# EAGLE design Header -LM35 Temp Sensor (EAGLE 6.3)
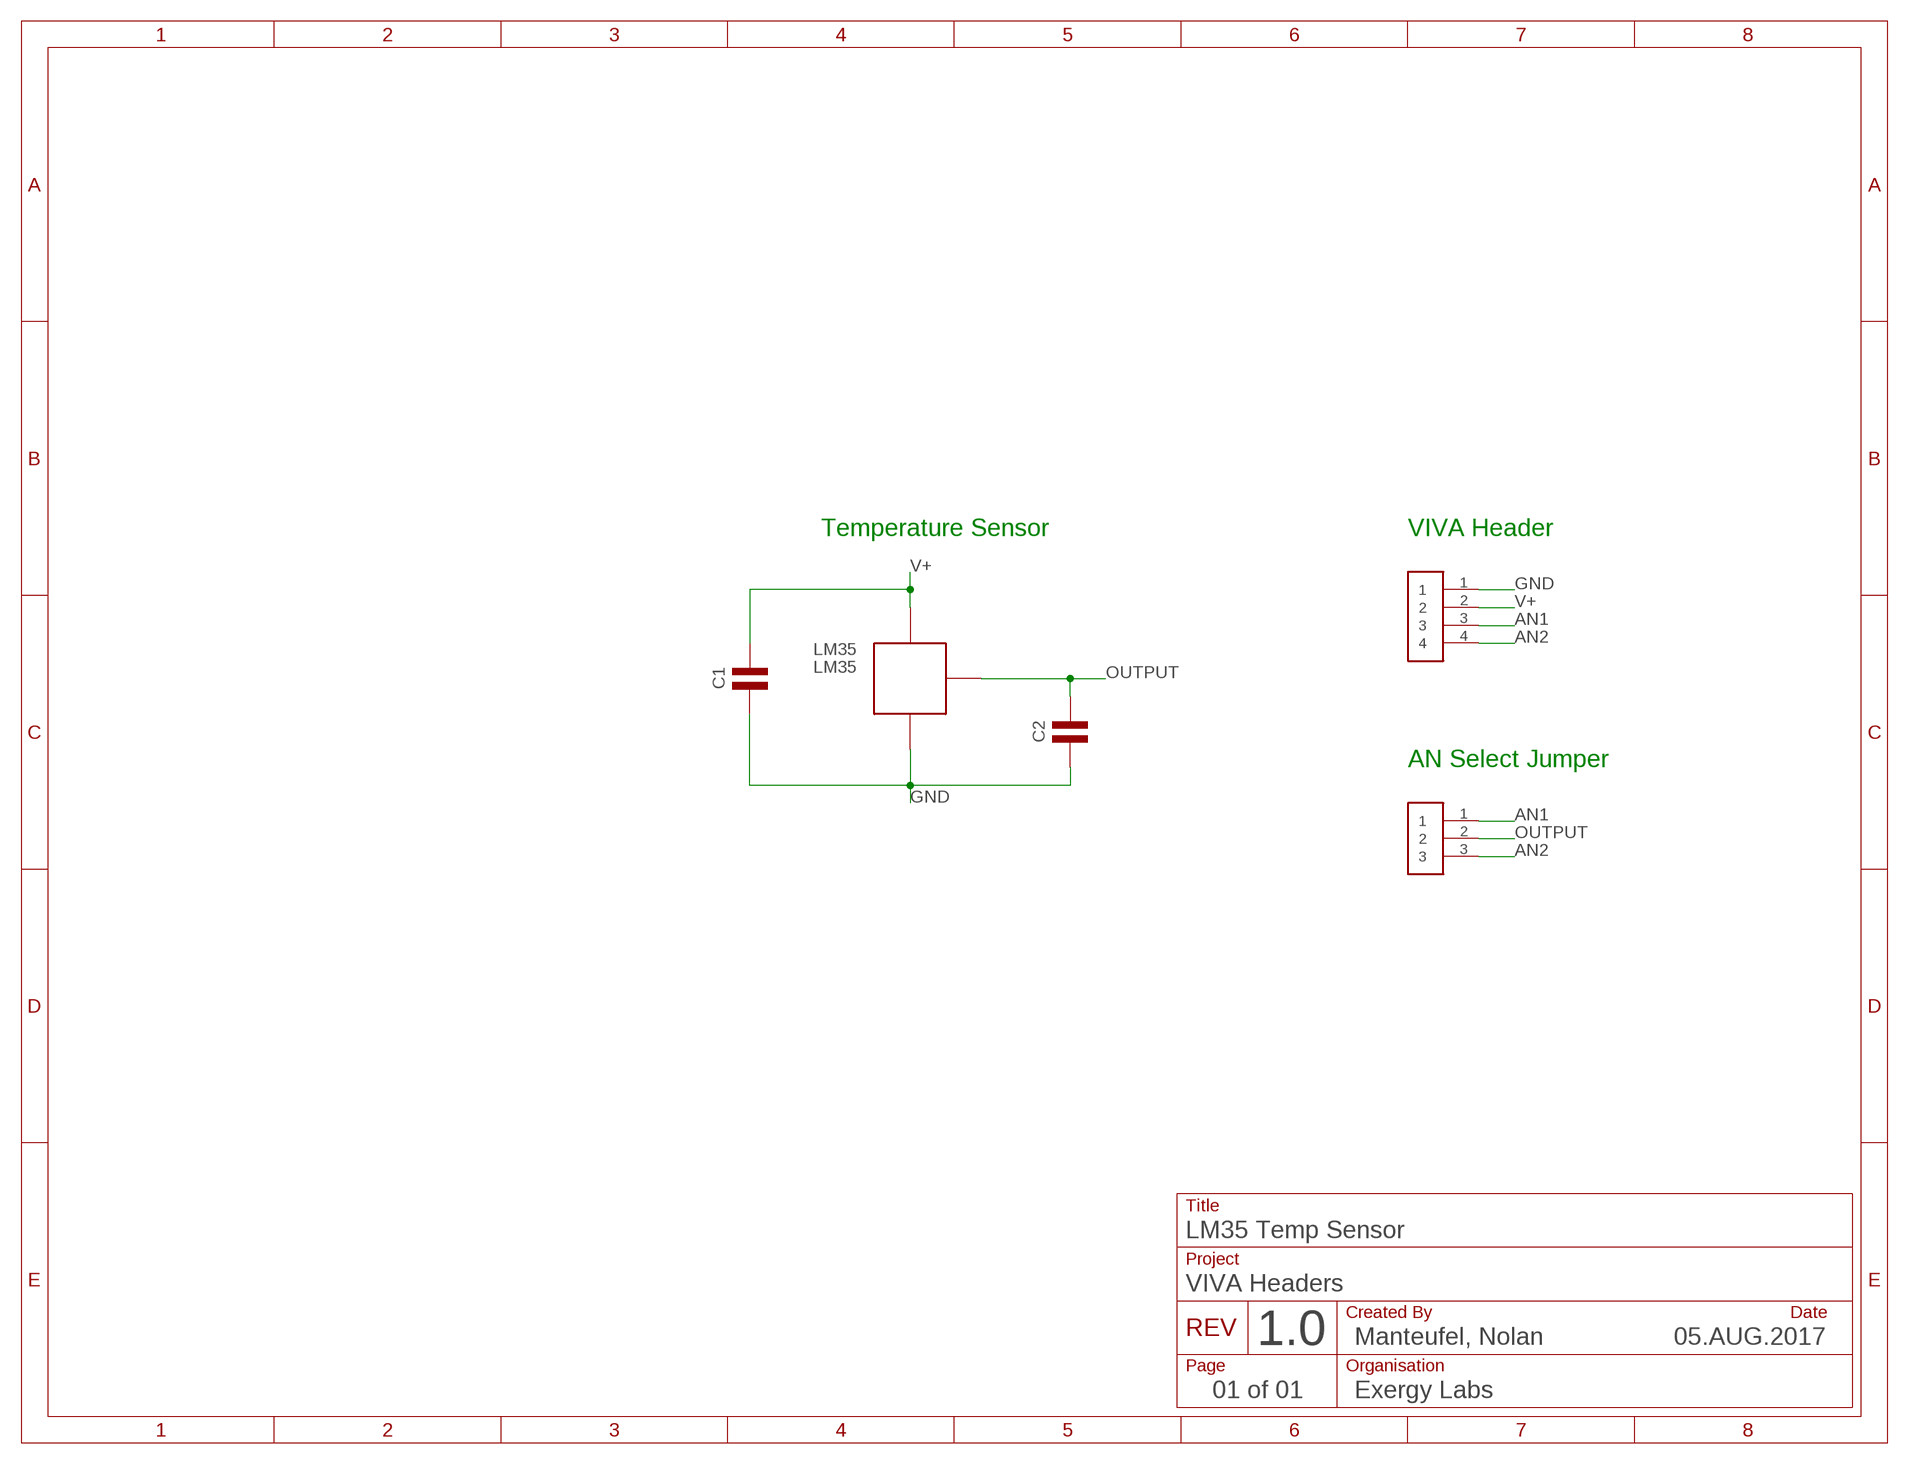
[diagram p0: schematic, sheet 1]

## Parts
C1  COVAL  [C050-024X044]
C2  COVAL  [C050-024X044]
LM35  LM35  [TO92-]
U$2  PINS_4  [PINS_4]
U$3  PINS_3  [PINS_3]

## Nets
AN1: U$2.3 U$3.1
AN2: U$2.4 U$3.3
GND: C1.1 C2.1 LM35.1(GND) U$2.1
OUTPUT: C2.2 LM35.2(VOUT) U$3.2
V+: C1.2 LM35.3(+V) U$2.2

## Notes on the sheet
- Temperature Sensor | VIVA Header
- AN Select Jumper
- Title
- LM35 Temp Sensor
- Project
- VIVA Headers
- Created By | Date
- 05.AUG.2017
- REV
- 1.0 | Manteufel, Nolan
- Page | Organisation
- 01 of 01 | Exergy Labs
- C:/Users/Nolan/Documents/eagle/VIVA  Board/Header - LM35 Temp Sensor/LM35 Temp Sensor - 05AUG2017.bmp

## Library data of the parts
C1 C2 = nolan-utsa:C
LM35 = nolan-utsa:LM35
U$2 = nolan-utsa:PINS_4
U$3 = nolan-utsa:PINS_3

## Board
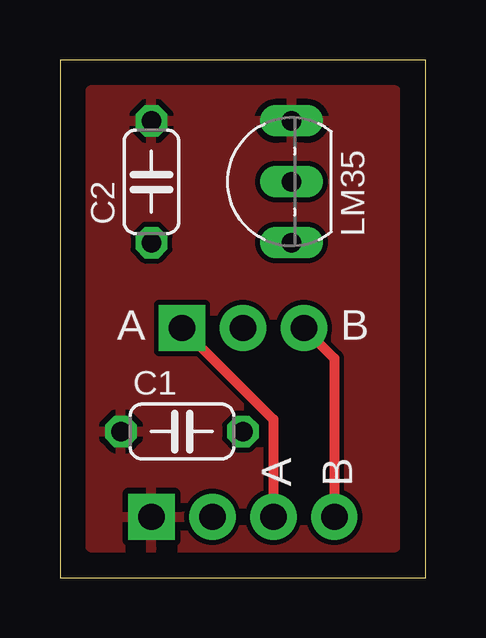
[diagram p1: board, top side]
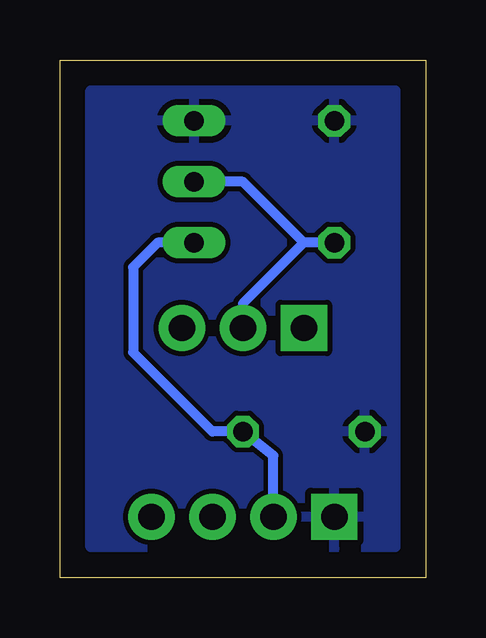
[diagram p2: board, bottom side, seen from below]

Size 15.24 x 21.59 mm. Coordinates in mm from the lower left corner, seen from the top.
Outline: 0,0 15.24,0 15.24,21.59 0,21.59 0,0
Copper layers (1*16): Top 0.035mm / dielectric 1.5mm / Bottom 0.035mm
Design rules "default": minimum track width 10mil, minimum drill 24mil, track to track 8mil, track to pad 8mil, pad to pad 8mil, via to via 8mil, smd to smd 8mil, copper to edge 40mil, drill to drill 8mil, minimum pad ring 10mil, minimum via ring 8mil, stop-mask expansion 4mil, vias tented up to drill 0mil, thermal gap 10mil

### Footprints (pad centres in the part's own frame; a part is rotated, then mirrored left to right if it is on the bottom)
C050-024X044 = drill 0.813 octagon: 1 -2.54,0; 2 2.54,0
TO92- = drill 0.813 long: 1 2.54,0; 2 0,0; 3 -2.54,0
PINS_4 = drill 1.1 pad 1.93 square: 1 0,0 | drill 1.1 pad 1.93: 2 2.54,0; 3 5.08,0; 4 7.62,0
PINS_3 = drill 1.1 pad 1.93 square: 1 0,0 | drill 1.1 pad 1.93: 2 2.54,0; 3 5.08,0

### Placement (x,y rotation side)
C1  5.08,6.1 0 top
C2  3.81,16.51 270 top
LM35  9.65,16.51 90 top
U$2  3.81,2.54 0 top
U$3  5.08,10.41 0 top

### Tracks (layer width: path | path; a pad name or v marks a point on that pad's centre or on a via)
AN1
  Top 0.406: U$3.1 8.89,6.6 U$2.3
AN2
  Top 0.406: U$3.3 11.43,9.14 U$2.4
GND
  pour Bottom: 1.27,1.27 13.97,1.27 13.97,20.32 1.27,20.32
  pour Top: 1.27,1.27 13.97,1.27 13.97,20.32 1.27,20.32
OUTPUT
  Bottom 0.406: 5.08,13.97 7.62,11.43 U$3.2 | C2.2 5.08,13.97 | 5.08,13.97 7.62,16.51 LM35.2
V+
  Bottom 0.406: U$2.2 6.35,5.08 C1.2 8.89,6.1 12.19,9.4 12.19,12.95 11.18,13.97 LM35.3

### Text on the board
tPlace: C2 | LM35 | A | B | C1 | A | B